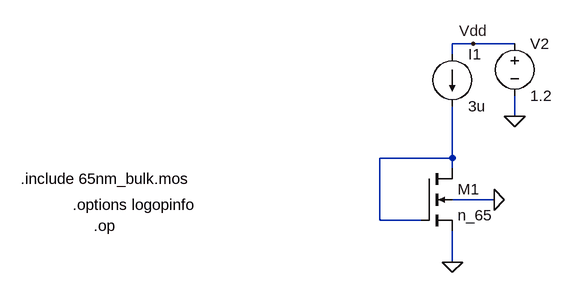
[diagram p0: schematic n_65_charact.asc]
n_65_charact.asc, the LTspice schematic file:
Version 4.1
SHEET 1 880 680
WIRE 336 -64 304 -64
WIRE 400 -64 336 -64
WIRE 304 -48 304 -64
WIRE 400 48 400 16
WIRE 304 112 304 32
WIRE 304 112 192 112
WIRE 304 128 304 112
WIRE 368 176 304 176
WIRE 192 208 192 112
WIRE 256 208 192 208
WIRE 304 272 304 224
FLAG 304 272 0
FLAG 400 48 0
FLAG 336 -64 Vdd
FLAG 368 176 0
SYMBOL voltage 400 -80 R0
WINDOW 123 0 0 Left 0
WINDOW 39 0 0 Left 0
SYMATTR InstName V2
SYMATTR Value 1.2
SYMBOL current 304 -48 R0
WINDOW 123 0 0 Left 0
WINDOW 39 0 0 Left 0
SYMATTR InstName I1
SYMATTR Value 3u
SYMBOL nmos4 256 128 R0
SYMATTR InstName M1
SYMATTR Value n_65
SYMATTR Value2 l=180n w=5u
TEXT -360 144 Left 2 !.include 65nm_bulk.mos
TEXT -280 184 Left 2 !.options logopinfo
TEXT -248 216 Left 2 !.op

The netlist it stands for:
* n_65_charact.asc
V2 Vdd 0 1.2
I1 Vdd N001 3u
M1 N001 N001 0 0 n_65 l=180n w=5u
.model NMOS NMOS
.model PMOS PMOS
.lib standard.mos
.include 65nm_bulk.mos
.options logopinfo
.op
.backanno
.end